# EAGLE design RemoteControl (EAGLE 7.1.0)
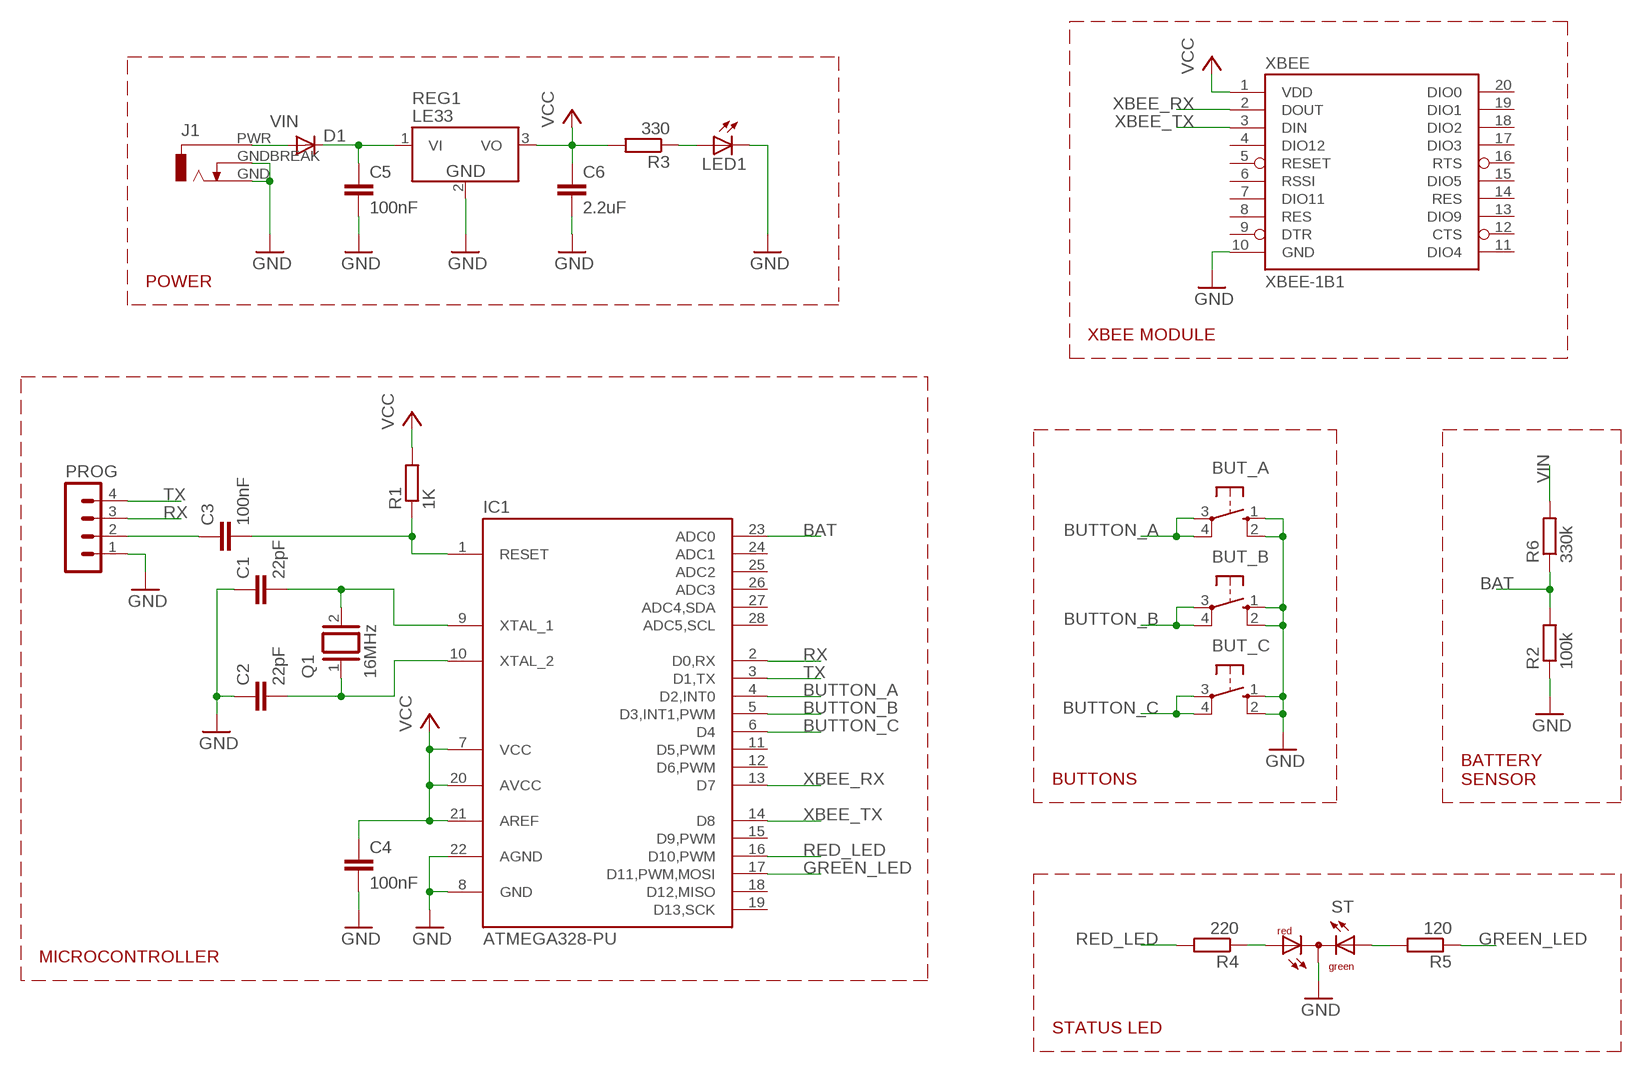
[diagram p0: schematic, sheet 1]

## Parts
BUT_A  40-XX  [B3F-40XX]
BUT_B  40-XX  [B3F-40XX]
BUT_C  40-XX  [B3F-40XX]
C1  22pF  C-EU050-024X044  [C050-024X044]
C2  22pF  C-EU050-024X044  [C050-024X044]
C3  100nF  C-EU050-025X075  [C050-025X075]
C4  100nF  C-EU050-025X075  [C050-025X075]
C5  100nF  C-EU050-025X075  [C050-025X075]
C6  2.2uF  C-EU050-035X075  [C050-035X075]
D1  1N4148DO35-7  [DO35-7]
IC1  ATMEGA328-PU  [DIL28-3]
J1  DC_JACKPTH  [POWER_JACK_PTH]
LED1  LED3MM  [LED3MM]
PROG  MA04-1  [MA04-1]
Q1  16MHz  XTAL/S  [QS]
R1  1K  R-EU_0207/7  [0207/7]
R2  100k  R-EU_0207/7  [0207/7]
R3  330  R-EU_0207/7  [0207/7]
R4  220  R-EU_0207/7  [0207/7]
R5  120  R-EU_0207/7  [0207/7]
R6  330k  R-EU_0207/7  [0207/7]
REG1  LE33  [TO-92]
ST  DUOLED-RG-C  [DUOLED-C-5MM]
XBEE  XBEE-1B1  [XBEE-1]

## Nets
BAT: IC1.23(ADC0) R2.2 R6.1
BUTTON_A: BUT_A.3(P) BUT_A.4(P1) IC1.4(D2,INT0)
BUTTON_B: BUT_B.3(P) BUT_B.4(P1) IC1.5(D3,INT1,PWM)
BUTTON_C: BUT_C.3(P) BUT_C.4(P1) IC1.6(D4)
GND: BUT_A.1(S) BUT_A.2(S1) BUT_B.1(S) BUT_B.2(S1) BUT_C.1(S) BUT_C.2(S1) C1.1 C2.1 C4.2 C5.2 C6.2 IC1.8(GND) IC1.22(AGND) J1.GND J1.GNDBREAK LED1.K(C) PROG.1 R2.1 REG1.2(GND) ST.C XBEE.10(GND)
GREEN_LED: IC1.17(D11,PWM,MOSI) R5.1
N$1: C1.2 IC1.9(XTAL_1) Q1.2
N$2: C2.2 IC1.10(XTAL_2) Q1.1
N$3: C5.1 D1.C REG1.1(VI)
N$5: C3.2 IC1.1(RESET) R1.1
N$6: C3.1 PROG.2
N$10: LED1.A R3.1
N$11: R4.1 ST.AR
N$12: R5.2 ST.AX(AG)
RED_LED: IC1.16(D10,PWM) R4.2
RX: IC1.2(D0,RX) PROG.3
TX: IC1.3(D1,TX) PROG.4
VCC: C4.1 C6.1 IC1.7(VCC) IC1.20(AVCC) IC1.21(AREF) R1.2 R3.2 REG1.3(VO) XBEE.1(VDD)
VIN: D1.A J1.PWR R6.2
XBEE_RX: IC1.13(D7) XBEE.2(DOUT)
XBEE_TX: IC1.14(D8) XBEE.3(DIN)
Unconnected: IC1.11(D5,PWM) IC1.12(D6,PWM) IC1.15(D9,PWM) IC1.18(D12,MISO) IC1.19(D13,SCK) IC1.24(ADC1) IC1.25(ADC2) IC1.26(ADC3) IC1.27(ADC4,SDA) IC1.28(ADC5,SCL) XBEE.4(DIO12) XBEE.5(RESET) XBEE.6(RSSI) XBEE.7(DIO11) XBEE.8(RES) XBEE.9(DTR) XBEE.11(DIO4) XBEE.12(CTS) XBEE.13(DIO9) XBEE.14(RES) XBEE.15(DIO5) XBEE.16(RTS) XBEE.17(DIO3) XBEE.18(DIO2) XBEE.19(DIO1) XBEE.20(DIO0)

## Notes on the sheet
- POWER
- XBEE MODULE
- BUTTONS
- BATTERY
  SENSOR
- MICROCONTROLLER
- STATUS LED

## Library data of the parts
BUT_A BUT_B BUT_C = switch-omron:40-XX: OMRON SWITCH; MF: OMRON COMPONENTS USA; MPN: B3F-4000; OC_FARNELL: 176434; OC_NEWARK: 36K3105
C1-C6 = resistor:C-EU: CAPACITOR, European symbol
D1 = diode:1N4148: DIODE high speed (Philips)
IC1 = Arduino:ATMEGA328-PU
J1 = Connectors:DC_JACK: DC POWER JACK Source: DCJ0303.pdf
LED1 = led:LED: LED OSRAM: - CHIPLED LG R971, LG N971, LY N971, LG Q971, LY Q971, LO R971, LY R971 LH N974, LH R974 LS Q976, LO Q976, LY Q976 LO Q996 - Hyper CHIPLED LW Q18S LB Q993, LB Q99A, LB R99A - SideLED LS A670, LO A670, LY A670, LG A670, LP A670 LB A673, LV A673, LT A673, LW A673 LH A674 LY A675 LS A676, LA A676, LO A676, LY A676, LW A676 LS A679, LY A679, LG A679 - Hyper Micro SIDELED® LS Y876, LA Y876, LO Y876, LY Y876 LT Y87S - SmartLED LW L88C, LW L88S LB L89C, LB L89S, LG L890 LS L89K, LO L89K, LY L89K LS L896, LA L896, LO L896, LY L896 - TOPLED LS T670, LO T670, LY T670, LG T670, LP T670 LSG T670, LSP T670, LSY T670, LOP T670, LYG T670 LG T671, LOG T671, LSG T671 LB T673, LV T673, LT T673, LW T673 LH T674 LS T676, LA T676, LO T676, LY T676, LB T676, LH T676, LSB T676, LW T676 LB T67C, LV T67C, LT T67C, LS T67K, LO T67K, LY T67K, LW E67C LS E67B, LA E67B, LO E67B, LY E67B, LB E67C, LV E67C, LT E67C LW T67C LS T679, LY T679, LG T679 LS T770, LO T770, LY T770, LG T770, LP T770 LB T773, LV T773, LT T773, LW T773 LH T774 LS E675, LA E675, LY E675, LS T675 LS T776, LA T776, LO T776, LY T776, LB T776 LHGB T686 LT T68C, LB T68C - Hyper Mini TOPLED® LB M676 - Mini TOPLED Santana® LG M470 LS M47K, LO M47K, LY M47K Source: http://www.osram.convergy.de LUXEON: - LUMILED® LXK2-PW12-R00, LXK2-PW12-S00, LXK2-PW14-U00, LXK2-PW14-V00 LXK2-PM12-R00, LXK2-PM12-S00, LXK2-PM14-U00 LXK2-PE12-Q00, LXK2-PE12-R00, LXK2-PE12-S00, LXK2-PE14-T00, LXK2-PE14-U00 LXK2-PB12-K00, LXK2-PB12-L00, LXK2-PB12-M00, LXK2-PB14-N00, LXK2-PB14-P00, LXK2-PB14-Q00 LXK2-PR12-L00, LXK2-PR12-M00, LXK2-PR14-Q00, LXK2-PR14-R00 LXK2-PD12-Q00, LXK2-PD12-R00, LXK2-PD12-S00 LXK2-PH12-R00, LXK2-PH12-S00 LXK2-PL12-P00, LXK2-PL12-Q00, LXK2-PL12-R00 Source: www.luxeon.com KINGBRIGHT: KA-3528ASYC Source: www.kingbright.com
PROG = con-lstb:MA04-1: PIN HEADER; OC_FARNELL: unknown; OC_NEWARK: unknown
Q1 = special:XTAL/S: CRYSTAL
R1-R6 = resistor:R-EU_: RESISTOR, European symbol
REG1 = Regulator:LE33
ST = led:DUOLED-RG-C: DUO LED 2 colors (red/green), 5 mm, round, common Cathode www.ligitek.com or other producers.
XBEE = Xbee:XBEE-1: Xbee module footprints SMT header is CONN-09042.

## Board
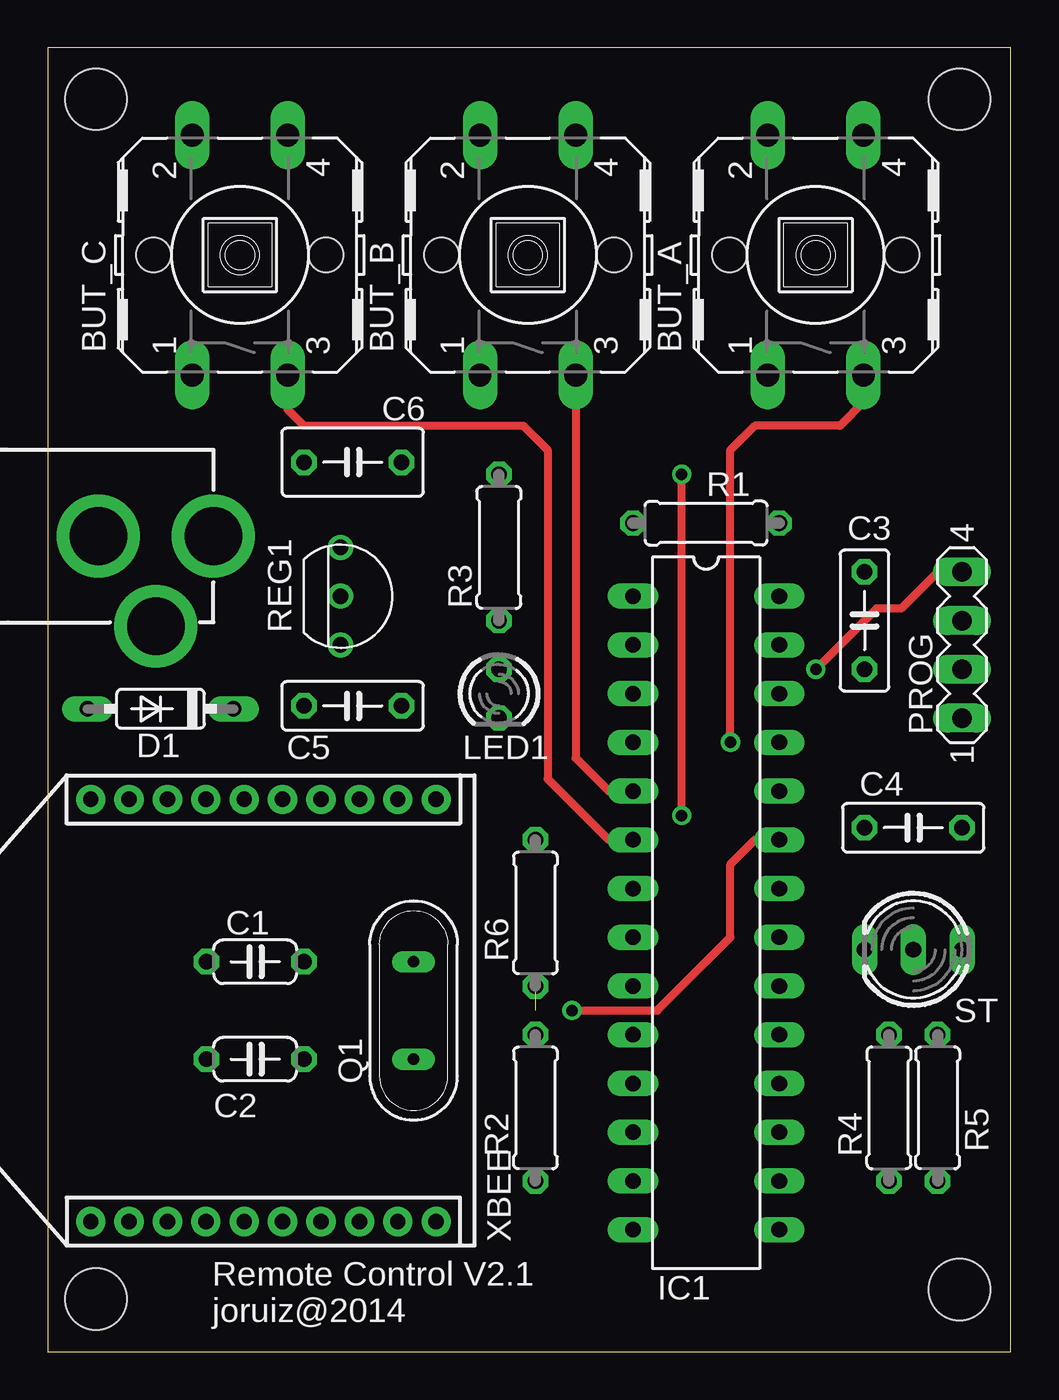
[diagram p1: board, top side]
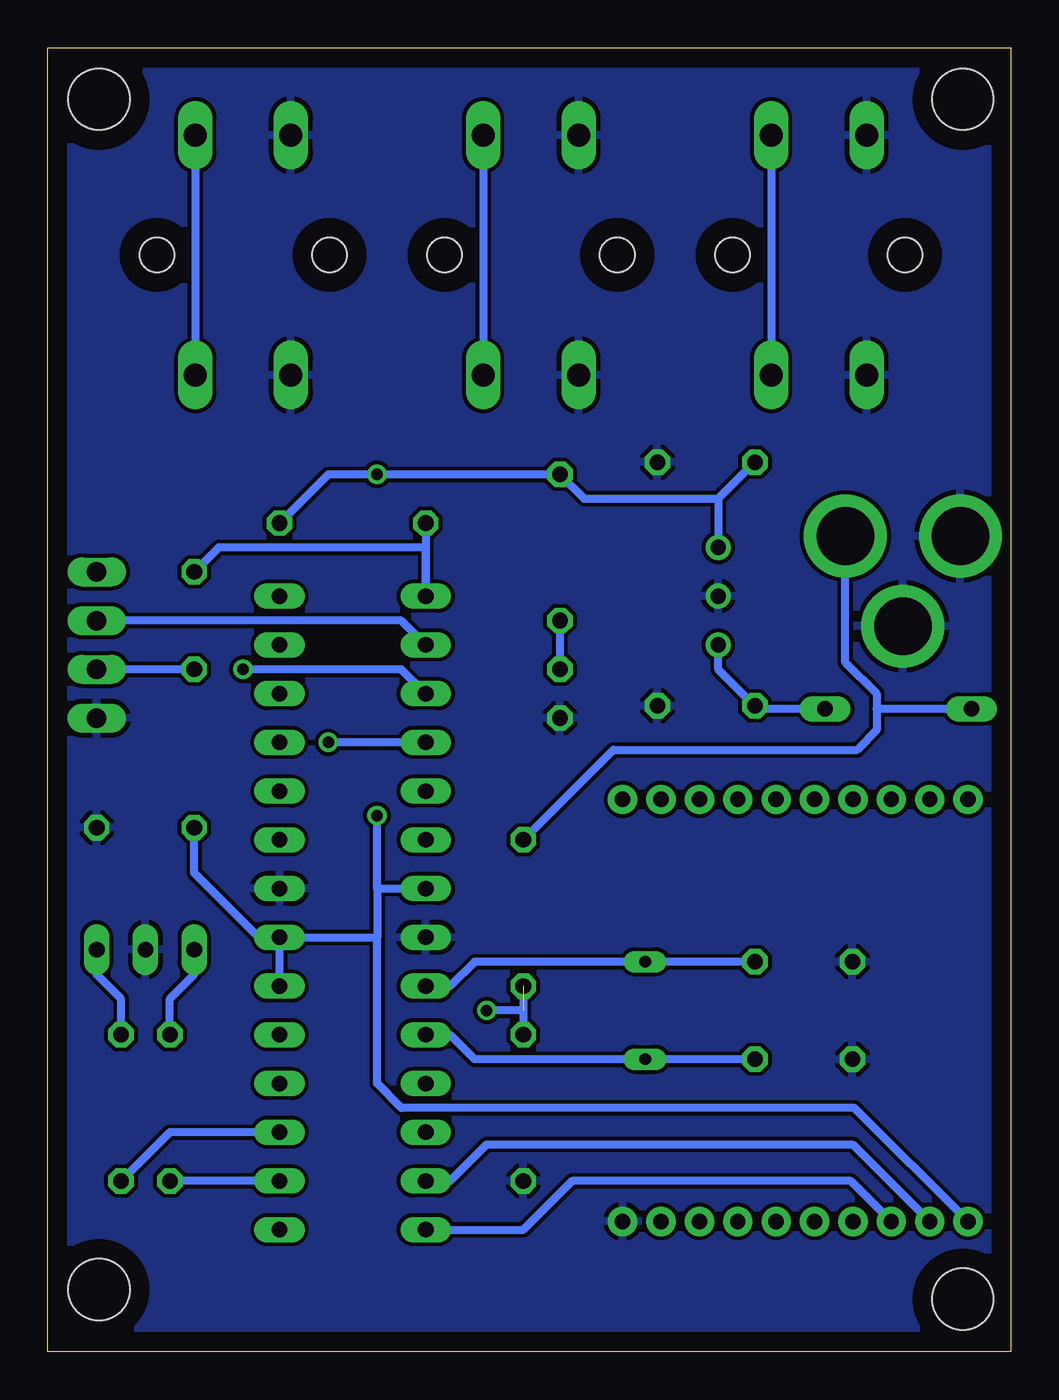
[diagram p2: board, bottom side, seen from below]

Size 50.16 x 67.95 mm. Coordinates in mm from the lower left corner, seen from the top.
Outline: 0,0 50.16,0 50.16,67.95 0,67.95 0,0
Copper layers (1*16): Top 0.035mm / dielectric 1.5mm / Bottom 0.035mm
Design rules "default": minimum track width 10mil, minimum drill 24mil, track to track 8mil, track to pad 8mil, pad to pad 8mil, via to via 8mil, smd to smd 8mil, copper to edge 40mil, drill to drill 8mil, minimum pad ring 10mil, minimum via ring 8mil, stop-mask expansion 4mil, vias tented up to drill 0mil, thermal gap 10mil
Holes 3.2 mm at 2.5,65.27 47.5,65.27 2.5,2.73 47.5,3.23

### Footprints (pad centres in the part's own frame; a part is rotated, then mirrored left to right if it is on the bottom)
B3F-40XX = drill 1.194 long: 1 -6.248,2.489; 2 6.248,2.489; 3 -6.248,-2.489; 4 6.248,-2.489 | hole 1.803: 0,-4.496; 0,4.496
C050-024X044 = drill 0.813 octagon: 1 -2.54,0; 2 2.54,0
C050-025X075 = drill 0.813 octagon: 1 -2.54,0; 2 2.54,0
C050-035X075 = drill 0.813 octagon: 1 -2.54,0; 2 2.54,0
DO35-7 = drill 0.813 long: A 3.81,0; C -3.81,0
DIL28-3 = drill 0.813 long: 1 -16.51,-3.81; 2 -13.97,-3.81; 3 -11.43,-3.81; 4 -8.89,-3.81; 5 -6.35,-3.81; 6 -3.81,-3.81; 7 -1.27,-3.81; 8 1.27,-3.81; 9 3.81,-3.81; 10 6.35,-3.81; 11 8.89,-3.81; 12 11.43,-3.81; 13 13.97,-3.81; 14 16.51,-3.81; 15 16.51,3.81; 16 13.97,3.81; 17 11.43,3.81; 18 8.89,3.81; 19 6.35,3.81; 20 3.81,3.81; 21 1.27,3.81; 22 -1.27,3.81; 23 -3.81,3.81; 24 -6.35,3.81; 25 -8.89,3.81; 26 -11.43,3.81; 27 -13.97,3.81; 28 -16.51,3.81
POWER_JACK_PTH = drill 2.997 pad 4.318: GND 0,7.7; GNDBREAK 4.7,10.7; PWR 0,13.7
LED3MM = drill 0.813 octagon: A -1.27,0; K 1.27,0
MA04-1 = drill 1.016 long: 1 -3.81,0; 2 -1.27,0; 3 1.27,0; 4 3.81,0
QS = drill 0.61 long: 1 -2.54,0; 2 2.54,0
0207/7 = drill 0.813 octagon: 1 -3.81,0; 2 3.81,0
TO-92 = drill 0.8: 1 -2.54,0; 2 0,0; 3 2.54,0
DUOLED-C-5MM = drill 0.813 long: AR 2.54,0; AX -2.54,0; C 0,0
XBEE-1 = drill 0.8 pad 1.524: 1 -11,20; 2 -11,18; 3 -11,16; 4 -11,14; 5 -11,12; 6 -11,10; 7 -11,8; 8 -11,6; 9 -11,4; 10 -11,2; 11 11,2; 12 11,4; 13 11,6; 14 11,8; 15 11,10; 16 11,12; 17 11,14; 18 11,16; 19 11,18; 20 11,20

### Placement (x,y rotation side)
BUT_A  40,57.15 90 top
BUT_B  25,57.15 90 top
BUT_C  10,57.15 90 top
C1  10.79,20.32 0 top
C2  10.79,15.24 0 top
C3  42.55,38.1 90 top
C4  45.09,27.3 0 top
C5  15.88,33.65 0 top
C6  15.88,46.35 0 top
D1  5.87,33.5 180 top
IC1  34.29,22.86 270 top
J1  -5.08,42.5 270 top
LED1  23.5,34.29 270 top
PROG  47.62,36.83 90 top
Q1  19.05,17.78 90 top
R1  34.29,43.18 0 top
R2  25.4,12.7 90 top
R3  23.5,41.91 90 top
R4  43.81,12.7 270 top
R5  46.35,12.7 90 top
R6  25.4,22.86 90 top
REG1  15.24,39.37 90 top
ST  45.09,20.96 180 top
XBEE  22.23,17.78 90 top

### Tracks (layer width: path | path; a pad name or v marks a point on that pad's centre or on a via)
BAT  (via drill 0.6)  (1 unrouted)
  Top 0.406: v27.3,17.78 31.75,17.78 35.56,21.59 35.56,25.4 36.83,26.67 IC1.23
  Bottom 0.406: 25.4,17.78 v27.3,17.78 | R6.1 R2.2
BUTTON_A  (via drill 0.6)
  Top 0.406: v35.56,31.75 35.56,46.99 36.83,48.26 41.27,48.26 42.49,49.47 BUT_A.3
  Bottom 0.406: BUT_A.4 BUT_A.3 | IC1.4 v35.56,31.75
BUTTON_B
  Top 0.406: BUT_B.3 27.49,30.93 29.21,29.21 IC1.5
  Bottom 0.406: BUT_B.4 BUT_B.3
BUTTON_C
  Top 0.406: BUT_C.3 12.49,49.11 13.34,48.26 24.77,48.26 26.04,46.99 26.04,29.84 29.21,26.67 IC1.6
  Bottom 0.406: BUT_C.4 BUT_C.3
GND
  pour Bottom: -0.64,68.58 50.8,68.58 50.8,-0.64 -0.64,-0.64
GREEN_LED
  Bottom 0.406: IC1.17 43.81,11.43 R5.1
N$1
  Bottom 0.406: C1.2 Q1.2 27.94,20.32 29.21,19.05 IC1.9
N$2
  Bottom 0.406: C2.2 Q1.1 27.94,15.24 29.21,16.51 IC1.10
N$3
  Bottom 0.406: D1.C 13.18,33.5 C5.1 15.24,35.56 REG1.1
N$5
  Bottom 0.406: R1.1 IC1.1 30.48,41.91 41.27,41.91 C3.2
N$6
  Bottom 0.406: C3.1 PROG.2
N$10
  Bottom 0.406: R3.1 LED1.A
N$11
  Bottom 0.406: R4.1 43.81,18.38 42.55,19.64 ST.AR
N$12
  Bottom 0.406: R5.2 46.35,18.38 47.62,19.64 ST.AX
RED_LED
  Bottom 0.406: IC1.16 R4.2
RX
  Bottom 0.406: IC1.2 31.75,38.1 PROG.3
TX  (via drill 0.6)
  Top 0.406: PROG.4 46.35,40.64 44.45,38.73 43.18,38.73 v40.01,35.56
  Bottom 0.406: IC1.3 31.75,35.56 v40.01,35.56
VCC  (via drill 0.6)
  Top 0.406: v33.02,27.94 v33.02,45.72
  Bottom 0.406: R1.2 35.56,45.72 v33.02,45.72 R3.2 22.23,44.45 15.24,44.45 | XBEE.1 8.14,12.7 31.75,12.7 33.02,13.97 33.02,21.59 | IC1.21 33.02,21.59 | 33.02,24.13 IC1.7 | IC1.20 IC1.21 | 33.02,24.13 v33.02,27.94 | C6.1 15.24,44.45 | 15.24,44.45 REG1.3 | 33.02,24.13 33.02,21.59 | IC1.21 39.19,21.59 42.55,24.95 C4.1
VIN
  Bottom 0.406: R6.2 20.7,31.36 8.01,31.36 6.99,32.38 6.99,33.5 | 6.99,33.5 6.99,34.29 8.62,35.92 J1.PWR | D1.A 6.99,33.5
XBEE_RX
  Bottom 0.406: XBEE.2 8.24,10.79 27.3,10.79 29.21,8.89 IC1.13
XBEE_TX
  Bottom 0.406: IC1.14 25.4,6.35 22.86,8.89 8.34,8.89 XBEE.3

### Text on the board
tNames: Remote Control V2.1 / joruiz@2014